# EAGLE design TDA7377 (EAGLE 7.2.0)
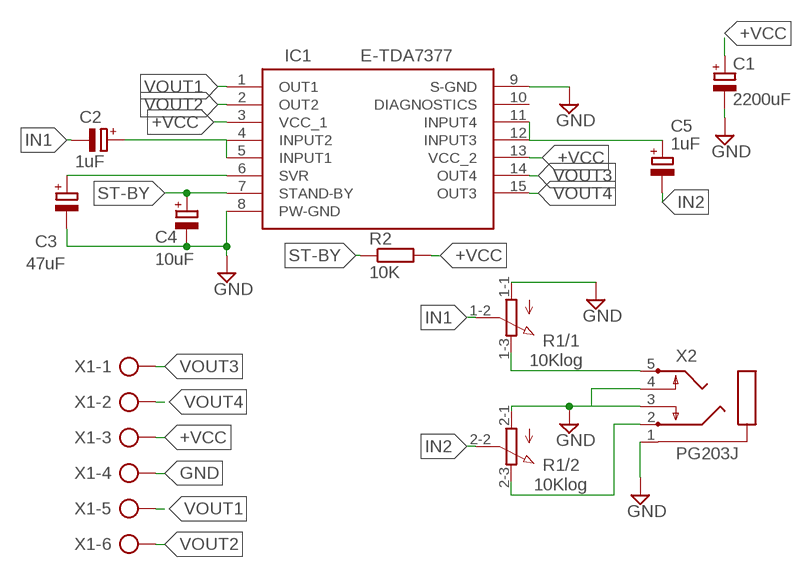
[diagram p0: schematic, sheet 1]

## Parts
C1  2200uF  CPOL-EUE5-13  [E5-13]
C2  1uF  CPOL-EUE2.5-6  [E2,5-6]
C3  47uF  CPOL-EUE2.5-6  [E2,5-6]
C4  10uF  CPOL-EUE2.5-5  [E2,5-5]
C5  1uF  CPOL-EUE5-5  [E5-5]
IC1  E-TDA7377  [TO127P500X2020X2210-15P]
R1  10Klog  3RP/1610G  [3RP/1610G]
R2  10K  R-EU_0207/10  [0207/10]
X1  AK500/6-H  [AK500/6-H]
X2  PG203J  [PG203J]

## Nets
+VCC: C1.+ IC1.3(VCC_1) IC1.13(VCC_2) R2.2 X1.3
GND: C1.- C3.- C4.- IC1.8(PW-GND) IC1.9(S-GND) R1.1-1(/1:A) R1.2-1(/2:A) X1.4 X2.1 X2.3 X2.4
IN1: C2.- R1.1-2(/1:S)
IN2: C5.- R1.2-2(/2:S)
N$1: C2.+ IC1.4(INPUT2) IC1.5(INPUT1)
N$2: C3.+ IC1.6(SVR)
N$4: C5.+ IC1.11(INPUT4) IC1.12(INPUT3)
N$5: R1.2-3(/2:E) X2.2
N$6: R1.1-3(/1:E) X2.5
ST-BY: C4.+ IC1.7(STAND-BY) R2.1
VOUT1: IC1.1(OUT1) X1.5
VOUT2: IC1.2(OUT2) X1.6
VOUT3: IC1.14(OUT4) X1.1
VOUT4: IC1.15(OUT3) X1.2
Unconnected: IC1.10(DIAGNOSTICS)

## Library data of the parts
C1-C5 = rcl:CPOL-EU: POLARIZED CAPACITOR, European symbol
IC1 = TDA7377:E-TDA7377: Audio Amplifiers 2X35W PWR AMPLIFIER Source: Datasheet <http://www.e-ele.net/DataSheet/TDA7377.pdf>; ARROW_PART_NUMBER: E-TDA7377; ARROW_PRICE-STOCK: https://www.arrow.com/en/products/e-tda7377/stmicroelectronics?region=nac; DESCRIPTION: Audio Amplifiers 2X35W PWR AMPLIFIER; HEIGHT: 5mm; MANUFACTURER_NAME: STMicroelectronics; MANUFACTURER_PART_NUMBER: E-TDA7377; MOUSER_PART_NUMBER: 511-E-TDA7377; MOUSER_PRICE-STOCK: https://www.mouser.co.uk/ProductDetail/STMicroelectronics/E-TDA7377?qs=lrqjml%252Bjt8dRZzTF6lEdfA%3D%3D
R1 = pot:3RP/1610G: 16mm Potentiometer two level Source: http://www.alphapotentiometers.net/html/16mm_pot_2.html
R2 = resistor:R-EU_: RESISTOR, European symbol
X1 = con-ptr500:AK500/6-H: CONNECTOR Aug. 2004 / PTR Meßtechnik: Die Bezeichnung der Serie AK505 wurde geändert. Es handelt sich hierbei um AK500 in horizontaler Ausführung.
X2 = con-hirschmann:PG203J: MIC/HEADPHONE JACK KS-S stereo microphone/headphone jack PG203JN (Schukat); OC_FARNELL: unknown; OC_NEWARK: unknown

## Board
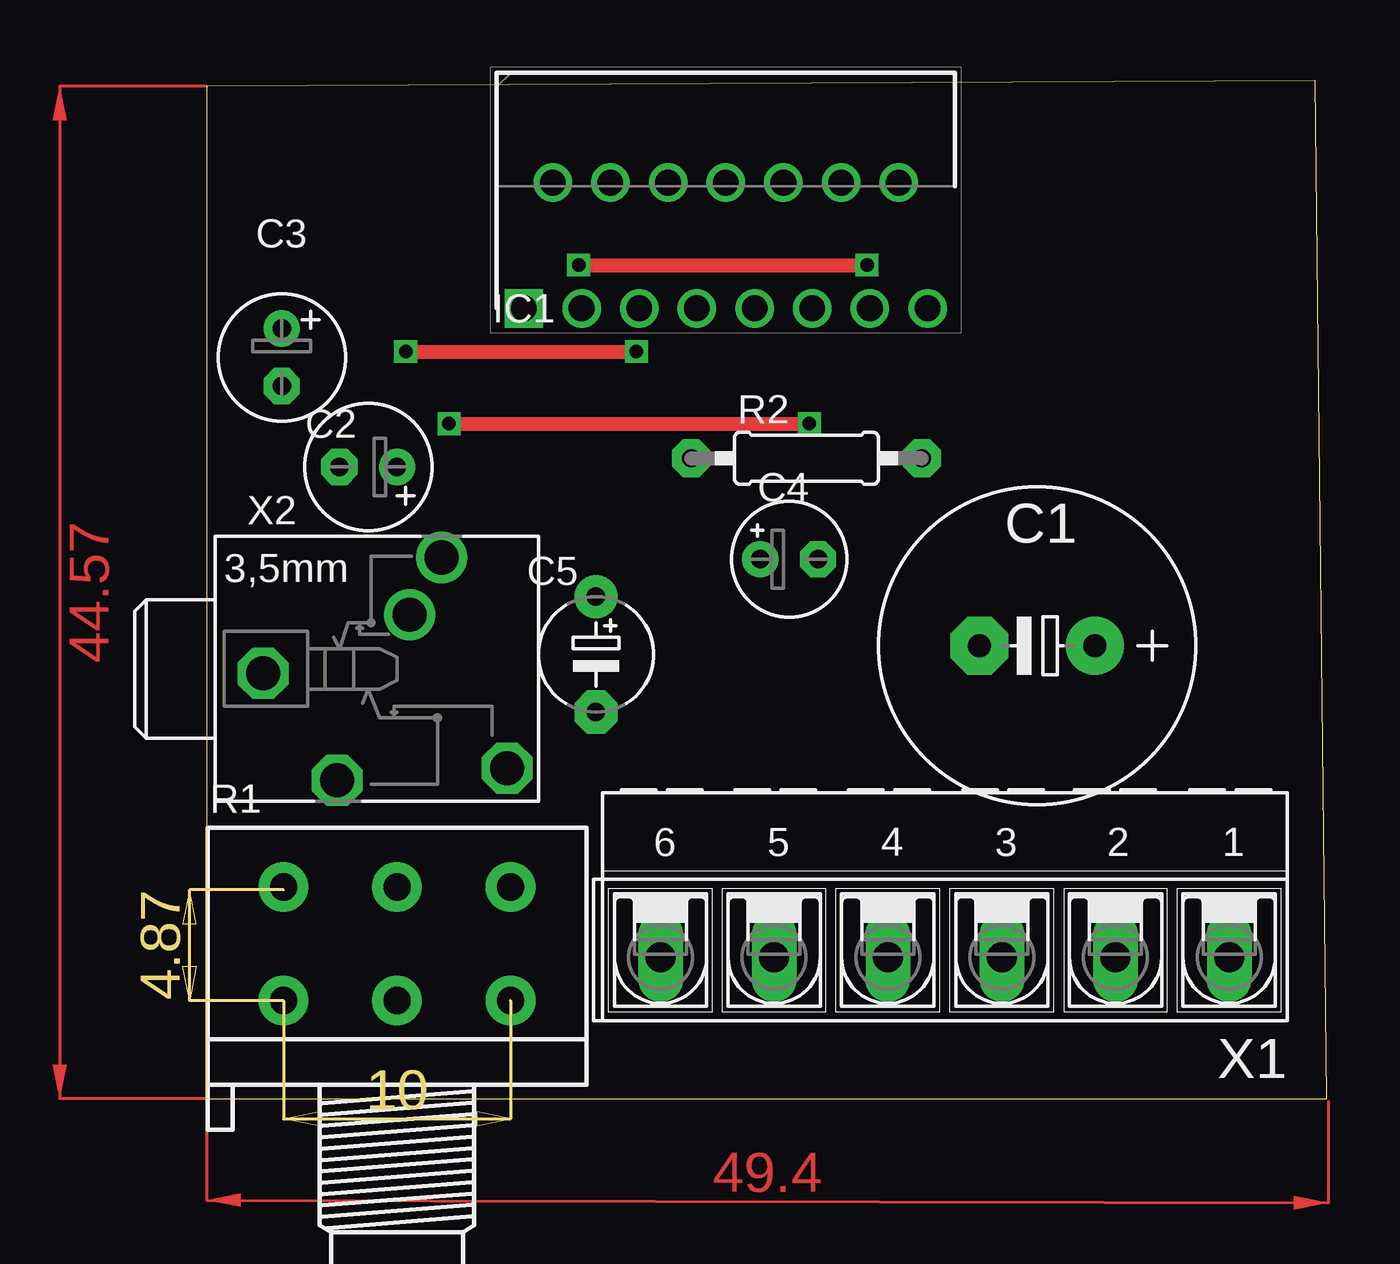
[diagram p1: board, top side]
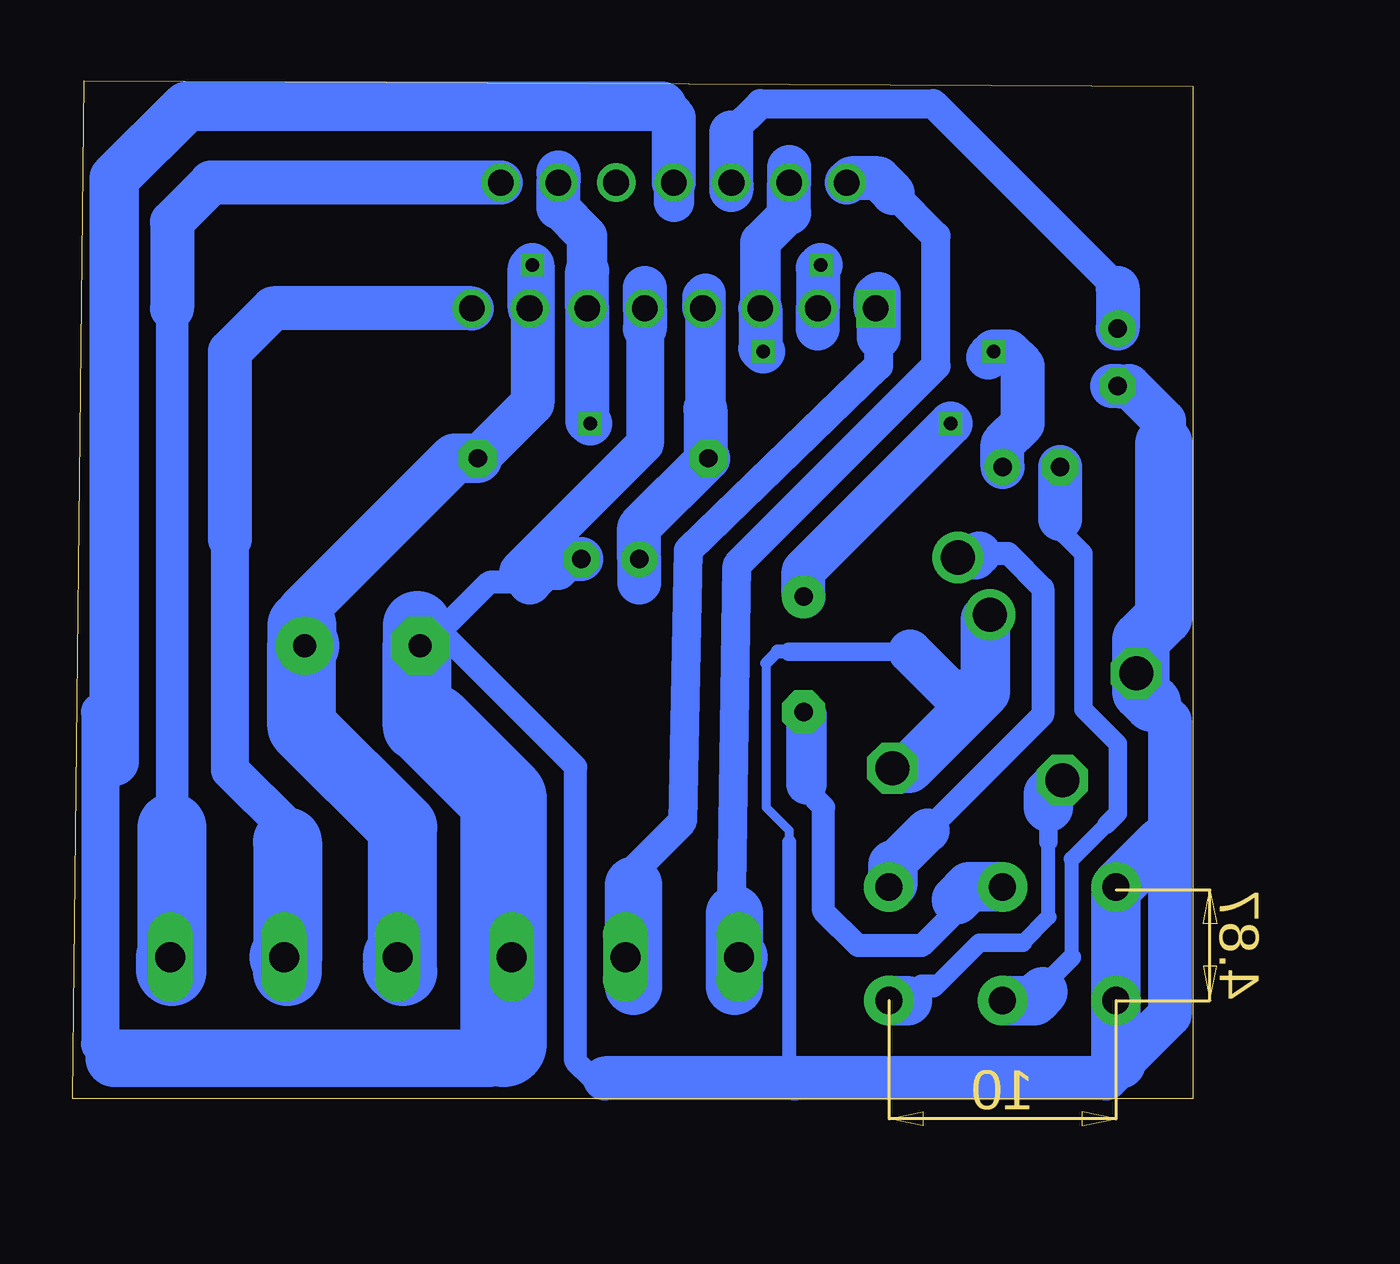
[diagram p2: board, bottom side, seen from below]

Size 49.33 x 44.82 mm. Coordinates in mm from the lower left corner, seen from the top.
Outline: 0,0 49.33,0 48.82,44.82 0,44.57 0,0
Copper layers (1*16): Top 0.035mm / dielectric 1.5mm / Bottom 0.035mm
Design rules "default": minimum track width 10mil, minimum drill 24mil, track to track 8mil, track to pad 8mil, pad to pad 8mil, via to via 8mil, smd to smd 8mil, copper to edge 40mil, drill to drill 8mil, minimum pad ring 10mil, minimum via ring 8mil, stop-mask expansion 4mil, vias tented up to drill 0mil, thermal gap 10mil

### Footprints (pad centres in the part's own frame; a part is rotated, then mirrored left to right if it is on the bottom)
E5-13 = drill 1.016 pad 2.54: + -2.54,0 | drill 1.016 pad 2.54 octagon: - 2.54,0
E2,5-6 = drill 0.813 pad 1.6: + -1.27,0 | drill 0.813 pad 1.6 octagon: - 1.27,0
E2,5-5 = drill 0.813 pad 1.6: + -1.27,0 | drill 0.813 pad 1.6 octagon: - 1.27,0
E5-5 = drill 0.813 pad 1.905: + -2.54,0 | drill 0.813 pad 1.905 octagon: - 2.54,0
TO127P500X2020X2210-15P = drill 1.13 pad 1.695 square: 1 0,0 | drill 1.13 pad 1.695: 2 1.27,5.53; 3 2.54,0; 4 3.81,5.53; 5 5.08,0; 6 6.35,5.53; 7 7.62,0; 8 8.89,5.53; 9 10.16,0; 10 11.43,5.53; 11 12.7,0; 12 13.97,5.53; 13 15.24,0; 14 16.51,5.53; 15 17.78,0
3RP/1610G = drill 1.2 pad 2.184: 1-1 -5,0; 1-2 0,0; 1-3 5,0; 2-1 -5,5; 2-2 0,5; 2-3 5,5
0207/10 = drill 0.813 pad 1.676 octagon: 1 -5.08,0; 2 5.08,0
AK500/6-H = drill 1.321 long: 1 -12.522,0; 2 -7.518,0; 3 -2.515,0; 4 2.515,0; 5 7.518,0; 6 12.522,0
PG203J = drill 1.499 octagon: 1 -5.004,-0.203; 4 5.74,-4.369; 5 -1.753,-4.902 | drill 1.499: 2 2.845,4.902; 3 1.448,2.388

### Placement (x,y rotation side)
C1  36.58,19.94 180 top
C2  7.11,27.81 180 top
C3  3.3,32.64 270 top
C4  25.65,23.75 0 top
C5  17.14,19.56 270 top
IC1  13.97,34.8 0 top
R1  8.38,4.32 0 top
R2  26.42,28.19 0 top
X1  32.51,6.22 180 top
X2  7.49,18.92 0 top

### Tracks (layer width: path | path; a pad name or v marks a point on that pad's centre or on a via)
+VCC  (via drill 0.6)
  Top 0.61: v16.38,36.7 v29.08,36.7
  Bottom 1.93: v16.38,36.7 16.51,36.58 IC1.3 16.51,33.91 | IC1.13 29.21,36.58 v29.08,36.7 29.08,30.61 R2.2
  Bottom 2.184: R2.2 32.51,28.19 39.24,21.46 39.24,20.07
  Bottom 3.048: X1.3 35.03,5.82 34.8,5.59 34.8,11.94 39.24,16.38 39.24,20.07 | 39.24,20.83 39.24,20.07 | 39.24,20.07 C1.+
GND
  Bottom 0.406: 17.78,8.51 17.78,8 | 18.8,19.18 18.8,12.83 17.78,11.81 17.78,11.3
  Bottom 0.508: 18.29,19.68 18.8,19.18
  Bottom 0.61: 17.78,19.68 18.29,19.68 | 17.53,0.89 17.78,1.14 17.78,8 17.78,11.3
  Bottom 0.813: 12.45,19.68 17.78,19.68
  Bottom 1.016: 25.91,0.89 26.42,0.89 27.18,1.65 27.18,14.61 33.02,20.45 33.27,20.45 | 33.27,20.45 33.53,20.45 C1.- | 29.21,22.73 30.99,22.73 33.27,20.45 | X1.4 30,4.04 30.35,3.68
  Bottom 1.676: 47.5,14.86 48.13,17.02 48.13,2.41 47.5,1.78 | 24.13,35.69 24.13,28.83 29.72,23.24 27.94,23.24 27.43,23.75
  Bottom 1.778: IC1.8 22.86,39.5
  Bottom 1.93: IC1.8 22.86,43.18 23.37,43.69 | 3.56,31.37 C3.- 2.79,31.37 1.27,29.85 1.27,28.83 | 1.78,17.4 1.02,16.64 1.02,3.68 3.18,1.52 3.81,0.89 17.53,0.89 25.91,0.89 | 24.13,33.91 IC1.9 24.13,35.69 | C4.- 27.43,23.75 28.19,23.75 29.21,22.73 | 9.14,17.91 10.67,17.91 12.45,19.68
  Bottom 2.184: 23.37,43.69 44.32,43.69 47.5,40.51 47.5,14.86 | 3.18,1.52 3.38,1.73 R1.1-1 3.38,9.19 1.27,11.3 1.4,11.3 R1.2-1 | 2.29,17.91 2.29,18.52 X2.1 | X2.4 12.5,14.55 9.14,17.91 9.14,21.11 X2.3
  Bottom 2.54: 47.5,1.78 30.99,1.78 30.35,2.41 | 1.27,28.83 1.27,21.21 2.29,20.19 2.29,17.91 1.78,17.4
  Bottom 3.048: 33.53,16.38 34.16,16.38 34.16,20.07 | 34.16,20.83 34.16,20.07 | 34.16,20.07 C1.-
  Bottom 3.81: 30.35,2.41 30.35,3.68 30.35,13.21 33.53,16.38
IN1
  Bottom 0.61: 5.33,6.22 5.33,10.54
  Bottom 0.711: 5.33,10.54 3.81,12.07
  Bottom 0.813: 6.6,4.7 6.6,4.95 5.33,6.22 | 3.81,12.07 3.3,12.57 3.3,15.62 4.83,17.14 4.83,24 6.35,25.53 6.35,27.3 C2.-
  Bottom 1.93: C2.- 5.84,25.53
  Bottom 2.184: R1.1-2 6.98,4.32 6.6,4.7
IN2
  Bottom 1.016: 10.41,8.76 10.41,8.25 11.94,6.73 14.73,6.73 16.26,8.25 16.26,12.83 17.02,13.59 17.02,13.84
  Bottom 1.778: 17.02,13.84 17.02,16.89 C5.-
  Bottom 2.184: R1.2-2 9.86,9.32 10.41,8.76
N$1  (via drill 0.6)
  Top 0.61: v8.76,32.89 v18.92,32.89
  Bottom 1.778: IC1.5 19.05,37.72 17.78,38.99
  Bottom 1.93: IC1.5 19.05,33.02 v18.92,32.89 | 9.02,32.64 v8.76,32.89 8.13,32.89 7.49,32.26 7.49,29.72 8.38,28.83 C2.+ | 17.78,38.99 IC1.4 17.78,41.02
N$2
  Bottom 1.27: 20.32,42.55 19.05,43.81 11.43,43.81 3.3,35.69
  Bottom 1.93: 20.32,40 IC1.6 20.32,42.55 | 3.3,35.69 C3.+
N$4  (via drill 0.6)
  Top 0.61: v10.67,29.72 v26.54,29.72
  Bottom 1.778: 26.67,36.45 26.67,37.97 27.94,39.24
  Bottom 1.93: C5.+ 17.14,23.24 v10.67,29.72 | v26.54,29.72 26.67,29.85 IC1.11 26.67,36.45 | 27.94,39.24 IC1.12 27.94,40.77
N$5
  Bottom 1.016: 9.4,24 8.13,24 6.6,22.48 6.6,16.89 11.68,11.81
  Bottom 1.93: X2.2 9.58,23.82 9.4,24 | 11.68,11.81 13.21,10.29
  Bottom 2.184: 13.21,10.29 13.21,9.49 R1.2-3
N$6
  Bottom 0.61: 6.35,8 6.35,11.3
  Bottom 0.711: 7.49,6.86 6.35,8
  Bottom 0.813: 11.43,4.95 11.3,4.95 9.4,6.86 7.49,6.86 | 6.35,11.3 6.35,12.83
  Bottom 1.016: 11.43,4.95 11.94,4.95 12.57,4.32
  Bottom 2.184: R1.1-3 12.57,4.32 | 6.35,12.83 6.35,13.41 X2.5
ST-BY
  Bottom 1.778: IC1.7 21.59,35.31 21.46,35.43 21.46,30.35
  Bottom 1.93: 21.46,30.35 21.46,28.32 R2.1 24.38,25.15 C4.+ 24.38,22.73
VOUT1
  Bottom 1.27: 13.84,33.53 13.84,32.26 22.23,24.13 22.48,12.19 24.64,10.03 24.64,9.4
  Bottom 1.93: IC1.1 13.97,35.31 13.84,35.43 13.84,33.53 | 24.64,4.95 24.64,5.87 X1.5
  Bottom 2.54: 24.64,9.4 24.64,4.95
VOUT2
  Bottom 1.27: 20.19,8.13 20.32,7.87 20.07,23.5 11.3,32.26 11.3,37.97 13.21,39.88
  Bottom 1.93: 13.21,39.88 13.84,40.51 15.05,40.51 IC1.2
  Bottom 2.54: X1.6 20.19,6.22 | 20.19,6.22 20.19,4.95 | 20.19,6.22 20.19,8.13
VOUT3
  Bottom 1.422: 44.96,34.8 44.96,15.11 44.96,14.48 44.96,11.94
  Bottom 1.93: IC1.14 43.24,40.33 44.96,38.61 44.96,34.8
  Bottom 3.048: X1.1 45.03,5.66 44.96,5.59 44.96,11.94
VOUT4
  Bottom 1.676: 42.42,24.64 42.42,14.48 39.88,11.94 39.88,11.3
  Bottom 1.93: IC1.15 40.51,34.8 42.42,32.89 42.42,24.64
  Bottom 3.048: 39.88,11.3 39.88,6.07 | 39.88,5.59 39.88,6.07 | 39.88,6.07 X1.2
(copper drawn outside any net)
  shapes: Top area x2